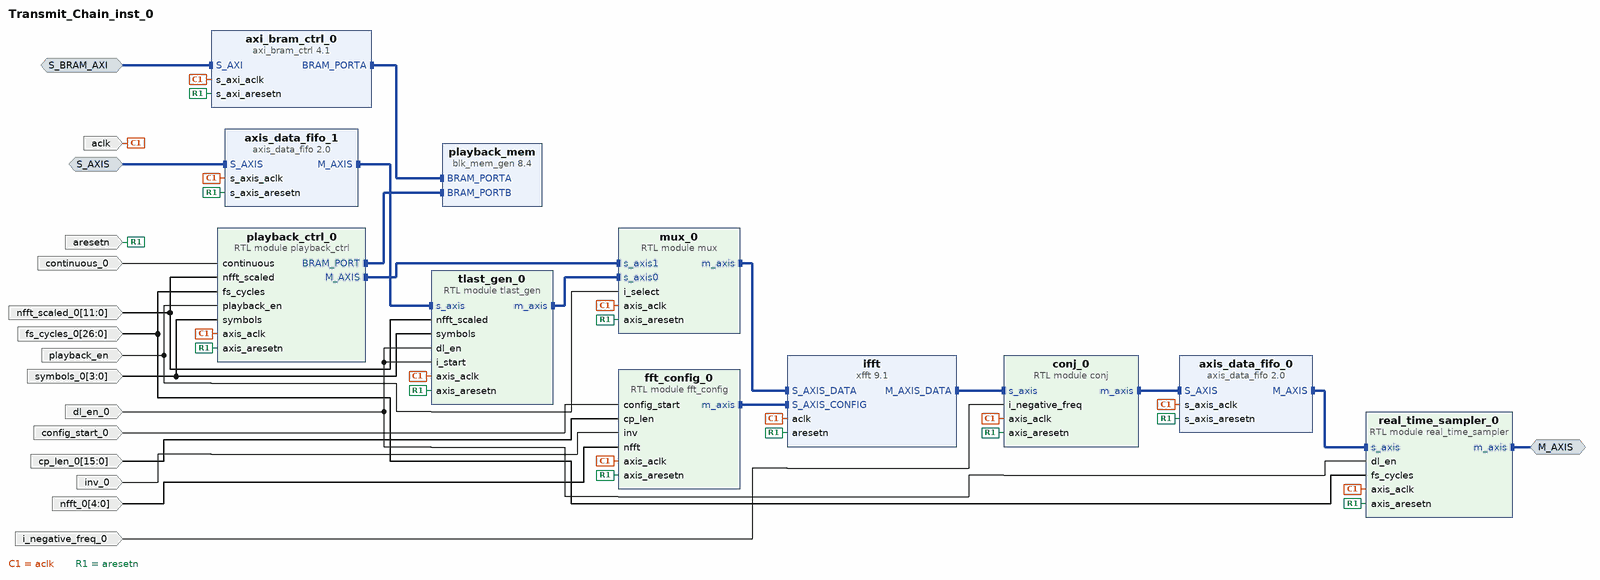
[diagram p0: block diagram of the top level]
# Vivado block design Transmit_Chain_inst_0, xc7z020clg400-1, Vivado 2022.1
create_bd_design Transmit_Chain_inst_0

create_bd_intf_port -mode Master -vlnv xilinx.com:interface:axis_rtl:1.0 M_AXIS
create_bd_intf_port -mode Slave -vlnv xilinx.com:interface:axis_rtl:1.0 S_AXIS
create_bd_intf_port -mode Slave -vlnv xilinx.com:interface:aximm_rtl:1.0 S_BRAM_AXI
create_bd_port -dir I -type clk aclk
create_bd_port -dir I -type rst aresetn
create_bd_port -dir I playback_en
create_bd_port -dir I config_start_0
create_bd_port -dir I continuous_0
create_bd_port -dir I -from 15 -to 0 cp_len_0
create_bd_port -dir I dl_en_0
create_bd_port -dir I -from 26 -to 0 fs_cycles_0
create_bd_port -dir I i_negative_freq_0
create_bd_port -dir I inv_0
create_bd_port -dir I -from 4 -to 0 nfft_0
create_bd_port -dir I -from 11 -to 0 nfft_scaled_0
create_bd_port -dir I -from 3 -to 0 symbols_0

create_bd_cell -type ip -vlnv xilinx.com:ip:axi_bram_ctrl:4.1 axi_bram_ctrl_0
set_property -dict {CONFIG.SINGLE_PORT_BRAM 1} [get_bd_cells axi_bram_ctrl_0]
create_bd_cell -type ip -vlnv xilinx.com:ip:axis_data_fifo:2.0 axis_data_fifo_0
set_property -dict {CONFIG.FIFO_DEPTH 16384 CONFIG.HAS_TLAST 1 CONFIG.TDATA_NUM_BYTES 4} [get_bd_cells axis_data_fifo_0]
create_bd_cell -type ip -vlnv xilinx.com:ip:axis_data_fifo:2.0 axis_data_fifo_1
set_property -dict [list \
  CONFIG.FIFO_DEPTH 512 \
  CONFIG.FIFO_MODE 1 \
  CONFIG.HAS_TLAST 1 \
  CONFIG.TDATA_NUM_BYTES 4 \
  CONFIG.TID_WIDTH 0 \
  CONFIG.TUSER_WIDTH 0 \
] [get_bd_cells axis_data_fifo_1]
create_bd_cell -type module -reference conj conj_0
create_bd_cell -type module -reference fft_config fft_config_0
create_bd_cell -type ip -vlnv xilinx.com:ip:xfft:9.1 ifft
set_property -dict [list \
  CONFIG.aresetn true \
  CONFIG.cyclic_prefix_insertion true \
  CONFIG.data_format fixed_point \
  CONFIG.implementation_options automatically_select \
  CONFIG.number_of_stages_using_block_ram_for_data_and_phase_factors 5 \
  CONFIG.output_ordering natural_order \
  CONFIG.run_time_configurable_transform_length true \
  CONFIG.scaling_options scaled \
  CONFIG.target_clock_frequency 100 \
  CONFIG.throttle_scheme nonrealtime \
  CONFIG.transform_length 4096 \
] [get_bd_cells ifft]
create_bd_cell -type module -reference mux mux_0
create_bd_cell -type module -reference playback_ctrl playback_ctrl_0
create_bd_cell -type ip -vlnv xilinx.com:ip:blk_mem_gen:8.4 playback_mem
set_property -dict [list \
  CONFIG.Assume_Synchronous_Clk false \
  CONFIG.Coe_File ../../../../../../../../../../modules/sim/coe_samples.coe \
  CONFIG.Enable_32bit_Address false \
  CONFIG.Enable_B Use_ENB_Pin \
  CONFIG.Fill_Remaining_Memory_Locations true \
  CONFIG.Load_Init_File true \
  CONFIG.Memory_Type True_Dual_Port_RAM \
  CONFIG.Port_B_Clock 100 \
  CONFIG.Port_B_Enable_Rate 100 \
  CONFIG.Port_B_Write_Rate 50 \
  CONFIG.Register_PortA_Output_of_Memory_Primitives true \
  CONFIG.Register_PortB_Output_of_Memory_Primitives true \
  CONFIG.Use_Byte_Write_Enable false \
  CONFIG.Use_RSTA_Pin false \
  CONFIG.Use_RSTB_Pin false \
  CONFIG.Write_Depth_A 4096 \
  CONFIG.use_bram_block Stand_Alone \
] [get_bd_cells playback_mem]
create_bd_cell -type module -reference real_time_sampler real_time_sampler_0
create_bd_cell -type module -reference tlast_gen tlast_gen_0

# ---- connections ----

connect_bd_intf_net -intf_net S_AXIS_1 [get_bd_intf_ports S_AXIS] [get_bd_intf_pins axis_data_fifo_1/S_AXIS]
connect_bd_intf_net [get_bd_intf_ports S_BRAM_AXI] [get_bd_intf_pins axi_bram_ctrl_0/S_AXI]
connect_bd_intf_net [get_bd_intf_pins axi_bram_ctrl_0/BRAM_PORTA] [get_bd_intf_pins playback_mem/BRAM_PORTA]
connect_bd_intf_net [get_bd_intf_pins axis_data_fifo_0/M_AXIS] [get_bd_intf_pins real_time_sampler_0/s_axis]
connect_bd_intf_net [get_bd_intf_pins axis_data_fifo_1/M_AXIS] [get_bd_intf_pins tlast_gen_0/s_axis]
connect_bd_intf_net [get_bd_intf_pins axis_data_fifo_0/S_AXIS] [get_bd_intf_pins conj_0/m_axis]
connect_bd_intf_net [get_bd_intf_pins fft_config_0/m_axis] [get_bd_intf_pins ifft/S_AXIS_CONFIG]
connect_bd_intf_net [get_bd_intf_pins conj_0/s_axis] [get_bd_intf_pins ifft/M_AXIS_DATA]
connect_bd_intf_net [get_bd_intf_pins ifft/S_AXIS_DATA] [get_bd_intf_pins mux_0/m_axis]
connect_bd_intf_net [get_bd_intf_pins playback_ctrl_0/BRAM_PORT] [get_bd_intf_pins playback_mem/BRAM_PORTB]
connect_bd_intf_net [get_bd_intf_pins mux_0/s_axis1] [get_bd_intf_pins playback_ctrl_0/M_AXIS]
connect_bd_intf_net [get_bd_intf_ports M_AXIS] [get_bd_intf_pins real_time_sampler_0/m_axis]
connect_bd_intf_net [get_bd_intf_pins mux_0/s_axis0] [get_bd_intf_pins tlast_gen_0/m_axis]
connect_bd_net -net config_start_0_1 [get_bd_ports config_start_0] [get_bd_pins fft_config_0/config_start]
connect_bd_net -net continuous_0_1 [get_bd_ports continuous_0] [get_bd_pins playback_ctrl_0/continuous]
connect_bd_net -net cp_len_0_1 [get_bd_ports cp_len_0] [get_bd_pins fft_config_0/cp_len]
connect_bd_net -net dl_en_0_1 [get_bd_ports dl_en_0] \
  [get_bd_pins real_time_sampler_0/dl_en] [get_bd_pins tlast_gen_0/dl_en] [get_bd_pins tlast_gen_0/i_start]
connect_bd_net -net fs_cycles_0_1 [get_bd_ports fs_cycles_0] [get_bd_pins playback_ctrl_0/fs_cycles] [get_bd_pins real_time_sampler_0/fs_cycles]
connect_bd_net -net i_negative_freq_0_1 [get_bd_ports i_negative_freq_0] [get_bd_pins conj_0/i_negative_freq]
connect_bd_net -net i_select_0_1 [get_bd_ports playback_en] [get_bd_pins mux_0/i_select] [get_bd_pins playback_ctrl_0/playback_en]
connect_bd_net -net inv_0_1 [get_bd_ports inv_0] [get_bd_pins fft_config_0/inv]
connect_bd_net -net nfft_0_1 [get_bd_ports nfft_0] [get_bd_pins fft_config_0/nfft]
connect_bd_net -net nfft_scaled_0_1 [get_bd_ports nfft_scaled_0] [get_bd_pins playback_ctrl_0/nfft_scaled] [get_bd_pins tlast_gen_0/nfft_scaled]
connect_bd_net -net s_axi_aclk_0_1 [get_bd_ports aclk] \
  [get_bd_pins axi_bram_ctrl_0/s_axi_aclk] [get_bd_pins axis_data_fifo_0/s_axis_aclk] \
  [get_bd_pins axis_data_fifo_1/s_axis_aclk] [get_bd_pins conj_0/axis_aclk] [get_bd_pins fft_config_0/axis_aclk] \
  [get_bd_pins ifft/aclk] [get_bd_pins mux_0/axis_aclk] [get_bd_pins playback_ctrl_0/axis_aclk] \
  [get_bd_pins real_time_sampler_0/axis_aclk] [get_bd_pins tlast_gen_0/axis_aclk]
connect_bd_net -net s_axi_aresetn_0_1 [get_bd_ports aresetn] \
  [get_bd_pins axi_bram_ctrl_0/s_axi_aresetn] [get_bd_pins axis_data_fifo_0/s_axis_aresetn] \
  [get_bd_pins axis_data_fifo_1/s_axis_aresetn] [get_bd_pins conj_0/axis_aresetn] [get_bd_pins fft_config_0/axis_aresetn] \
  [get_bd_pins ifft/aresetn] [get_bd_pins mux_0/axis_aresetn] [get_bd_pins playback_ctrl_0/axis_aresetn] \
  [get_bd_pins real_time_sampler_0/axis_aresetn] [get_bd_pins tlast_gen_0/axis_aresetn]
connect_bd_net -net symbols_0_1 [get_bd_ports symbols_0] [get_bd_pins playback_ctrl_0/symbols] [get_bd_pins tlast_gen_0/symbols]
set_property HDL_ATTRIBUTE.DEBUG true [get_bd_intf_nets S_AXIS_1]

# ---- address map ----
assign_bd_address -offset 0x0000 -range 16K -target_address_space [get_bd_addr_spaces S_BRAM_AXI] [get_bd_addr_segs axi_bram_ctrl_0/S_AXI/Mem0]

validate_bd_design
save_bd_design
